# EAGLE board AD9910_Finished_3rd (EAGLE 9.6.2), part 1 of 2
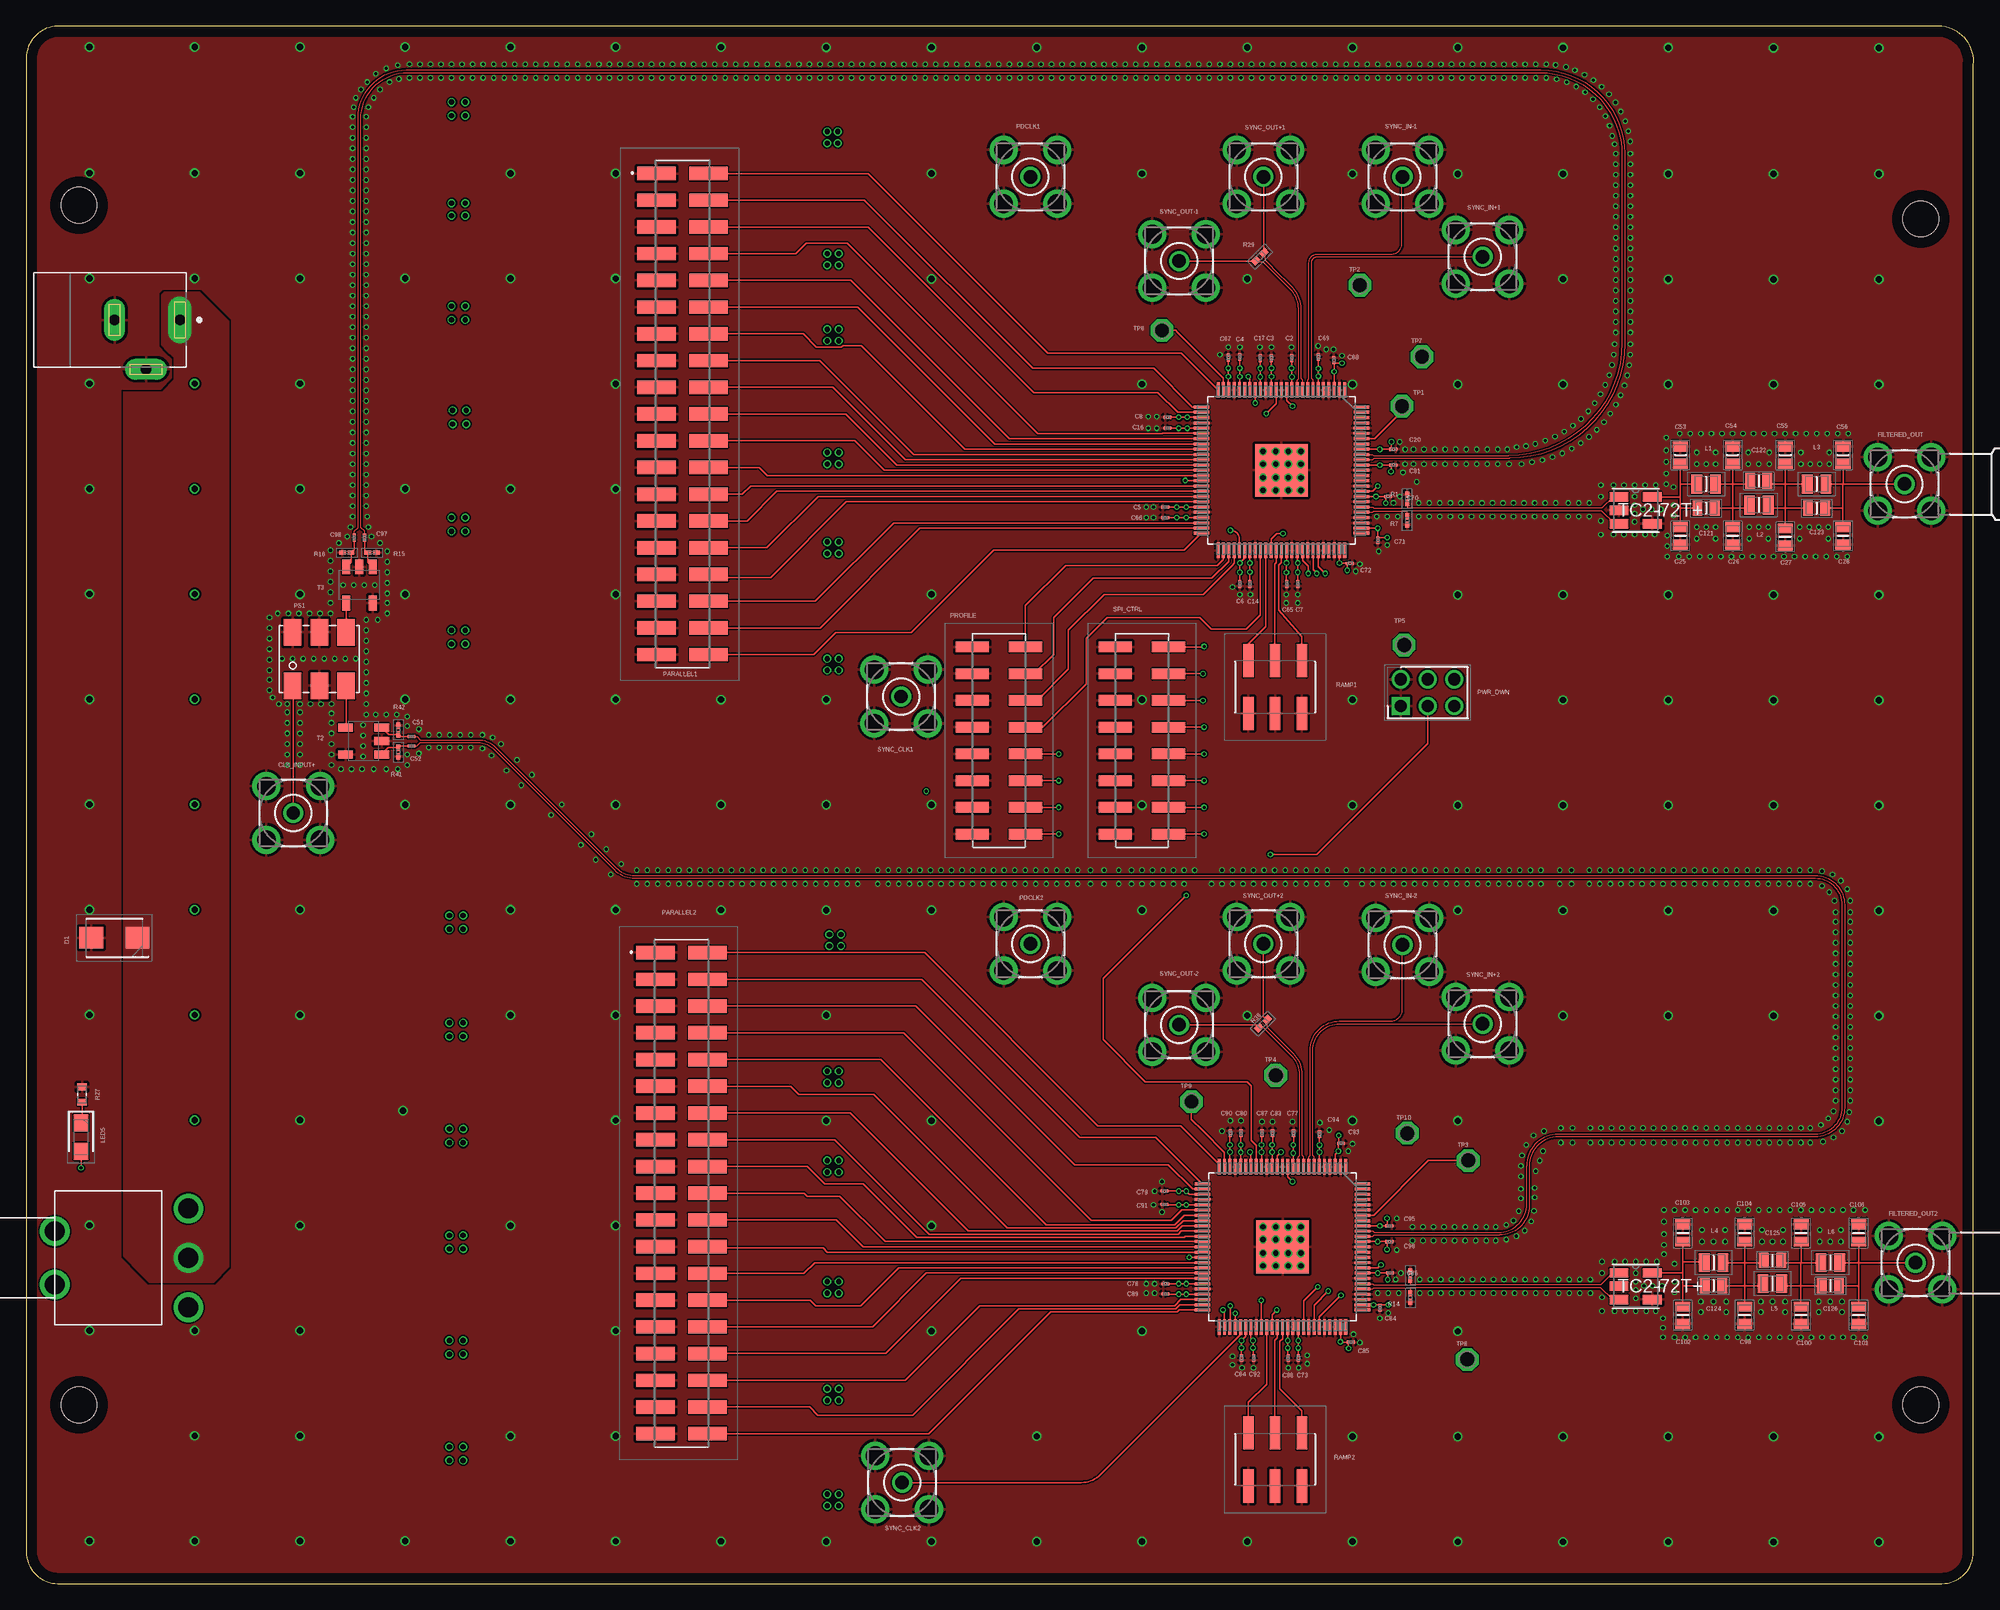
[diagram p8: board, top side]
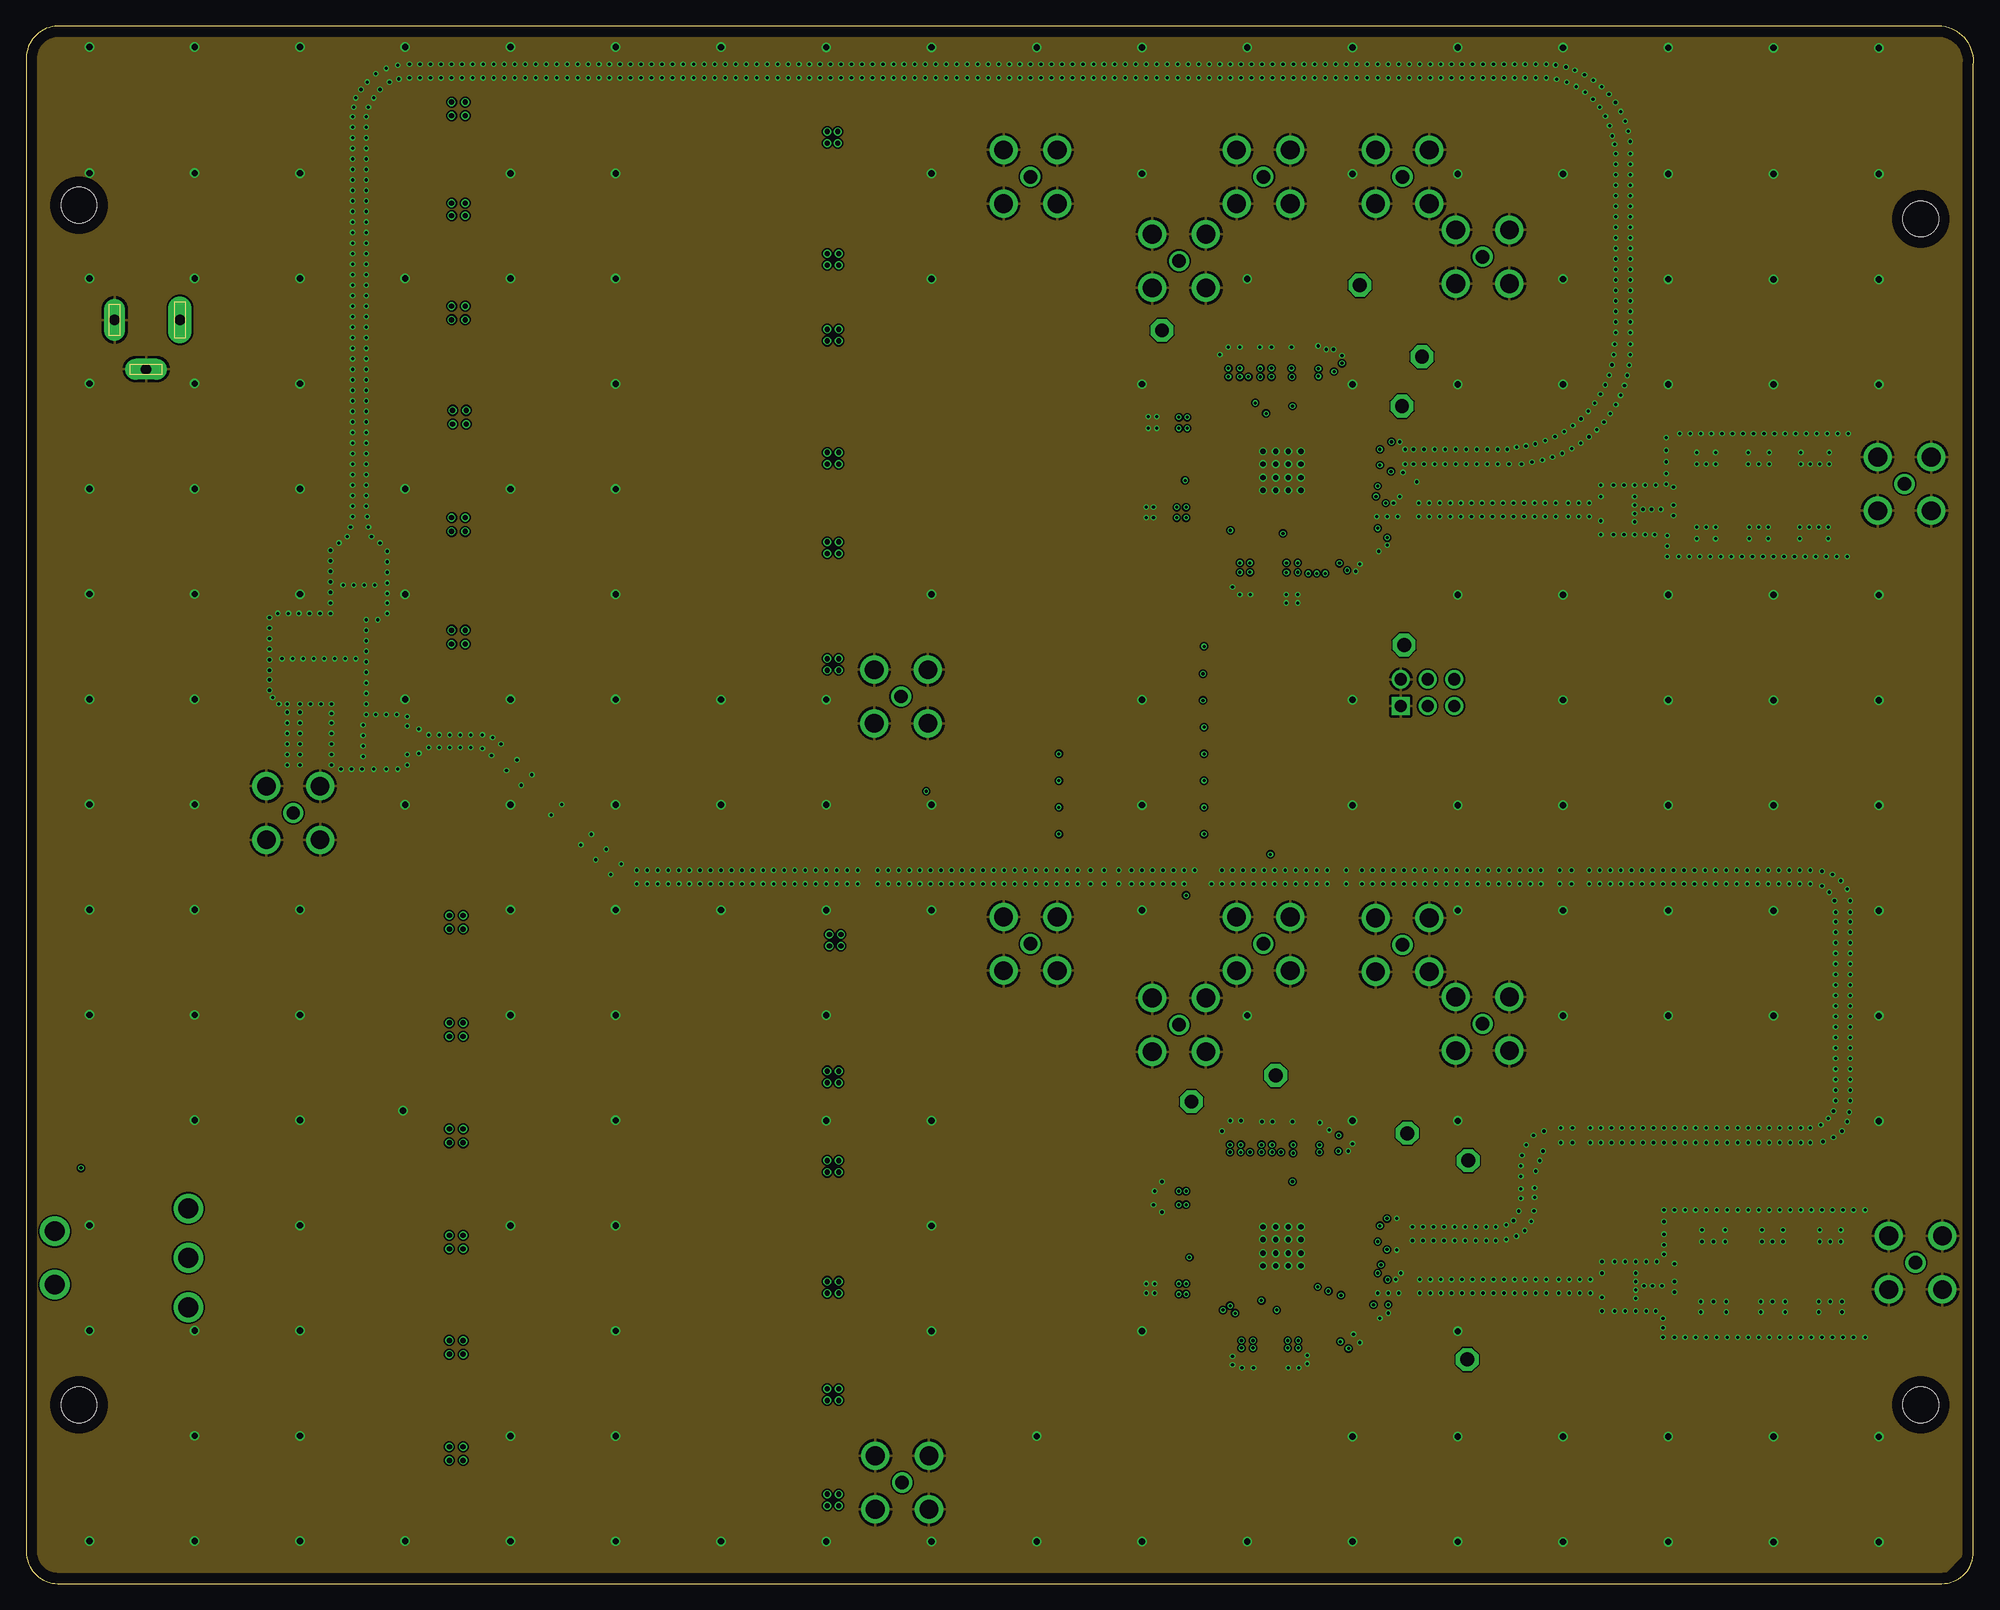
[diagram p9: board, inner layer GND]
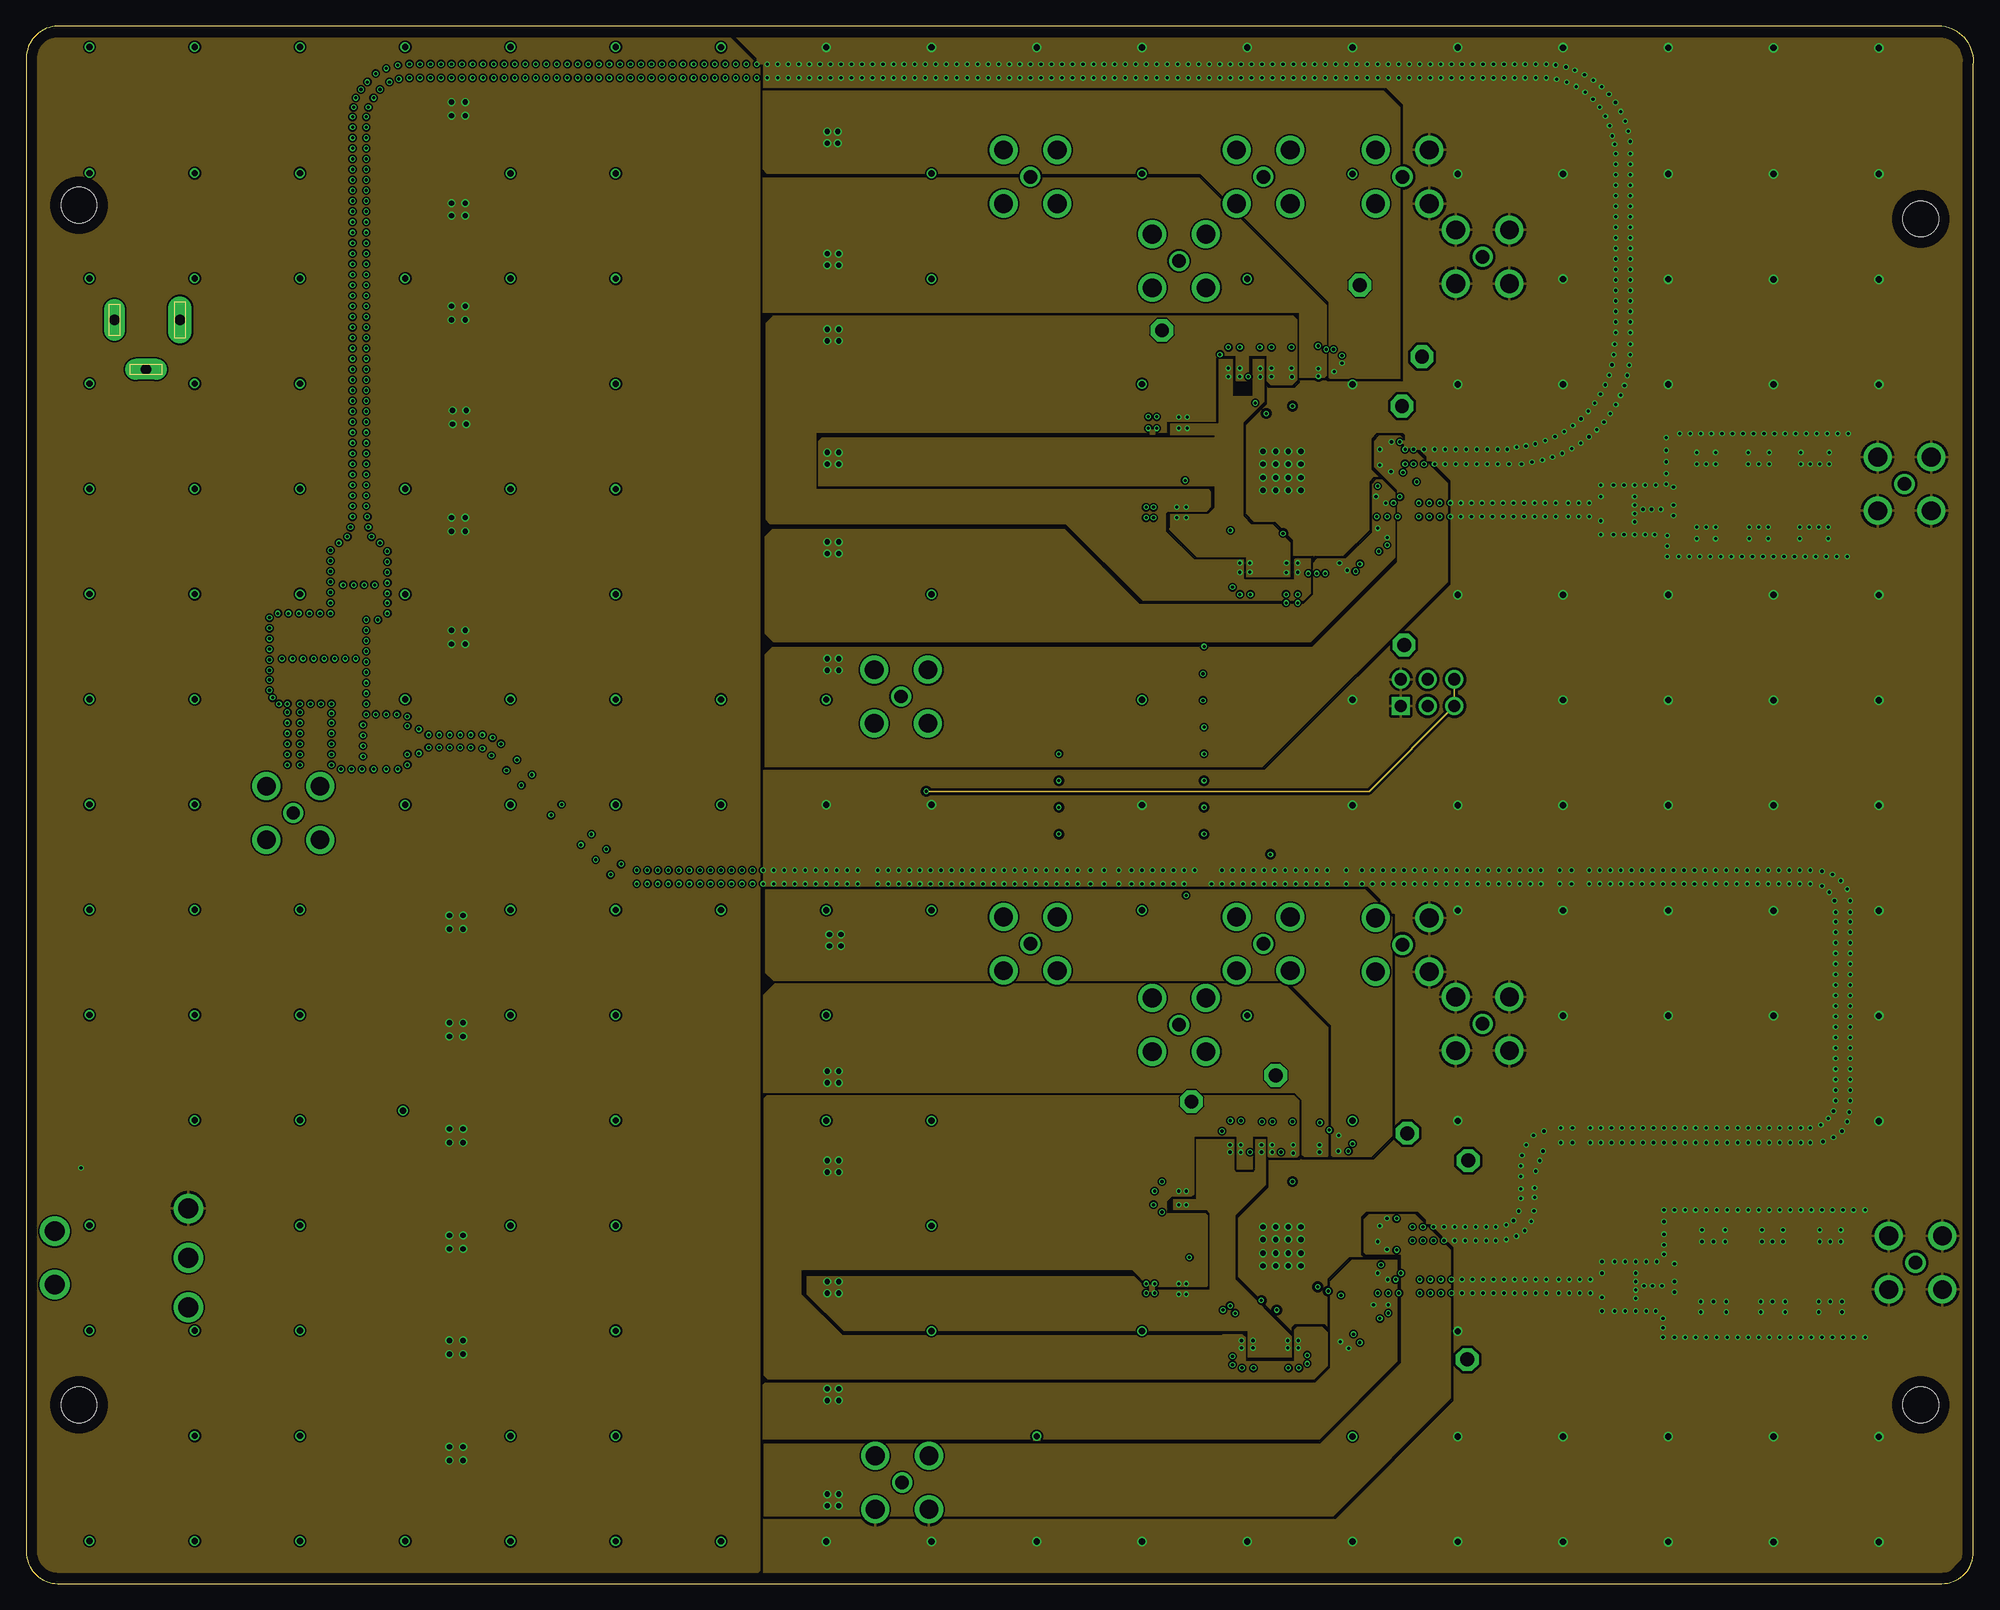
[diagram p10: board, inner layer VCC]
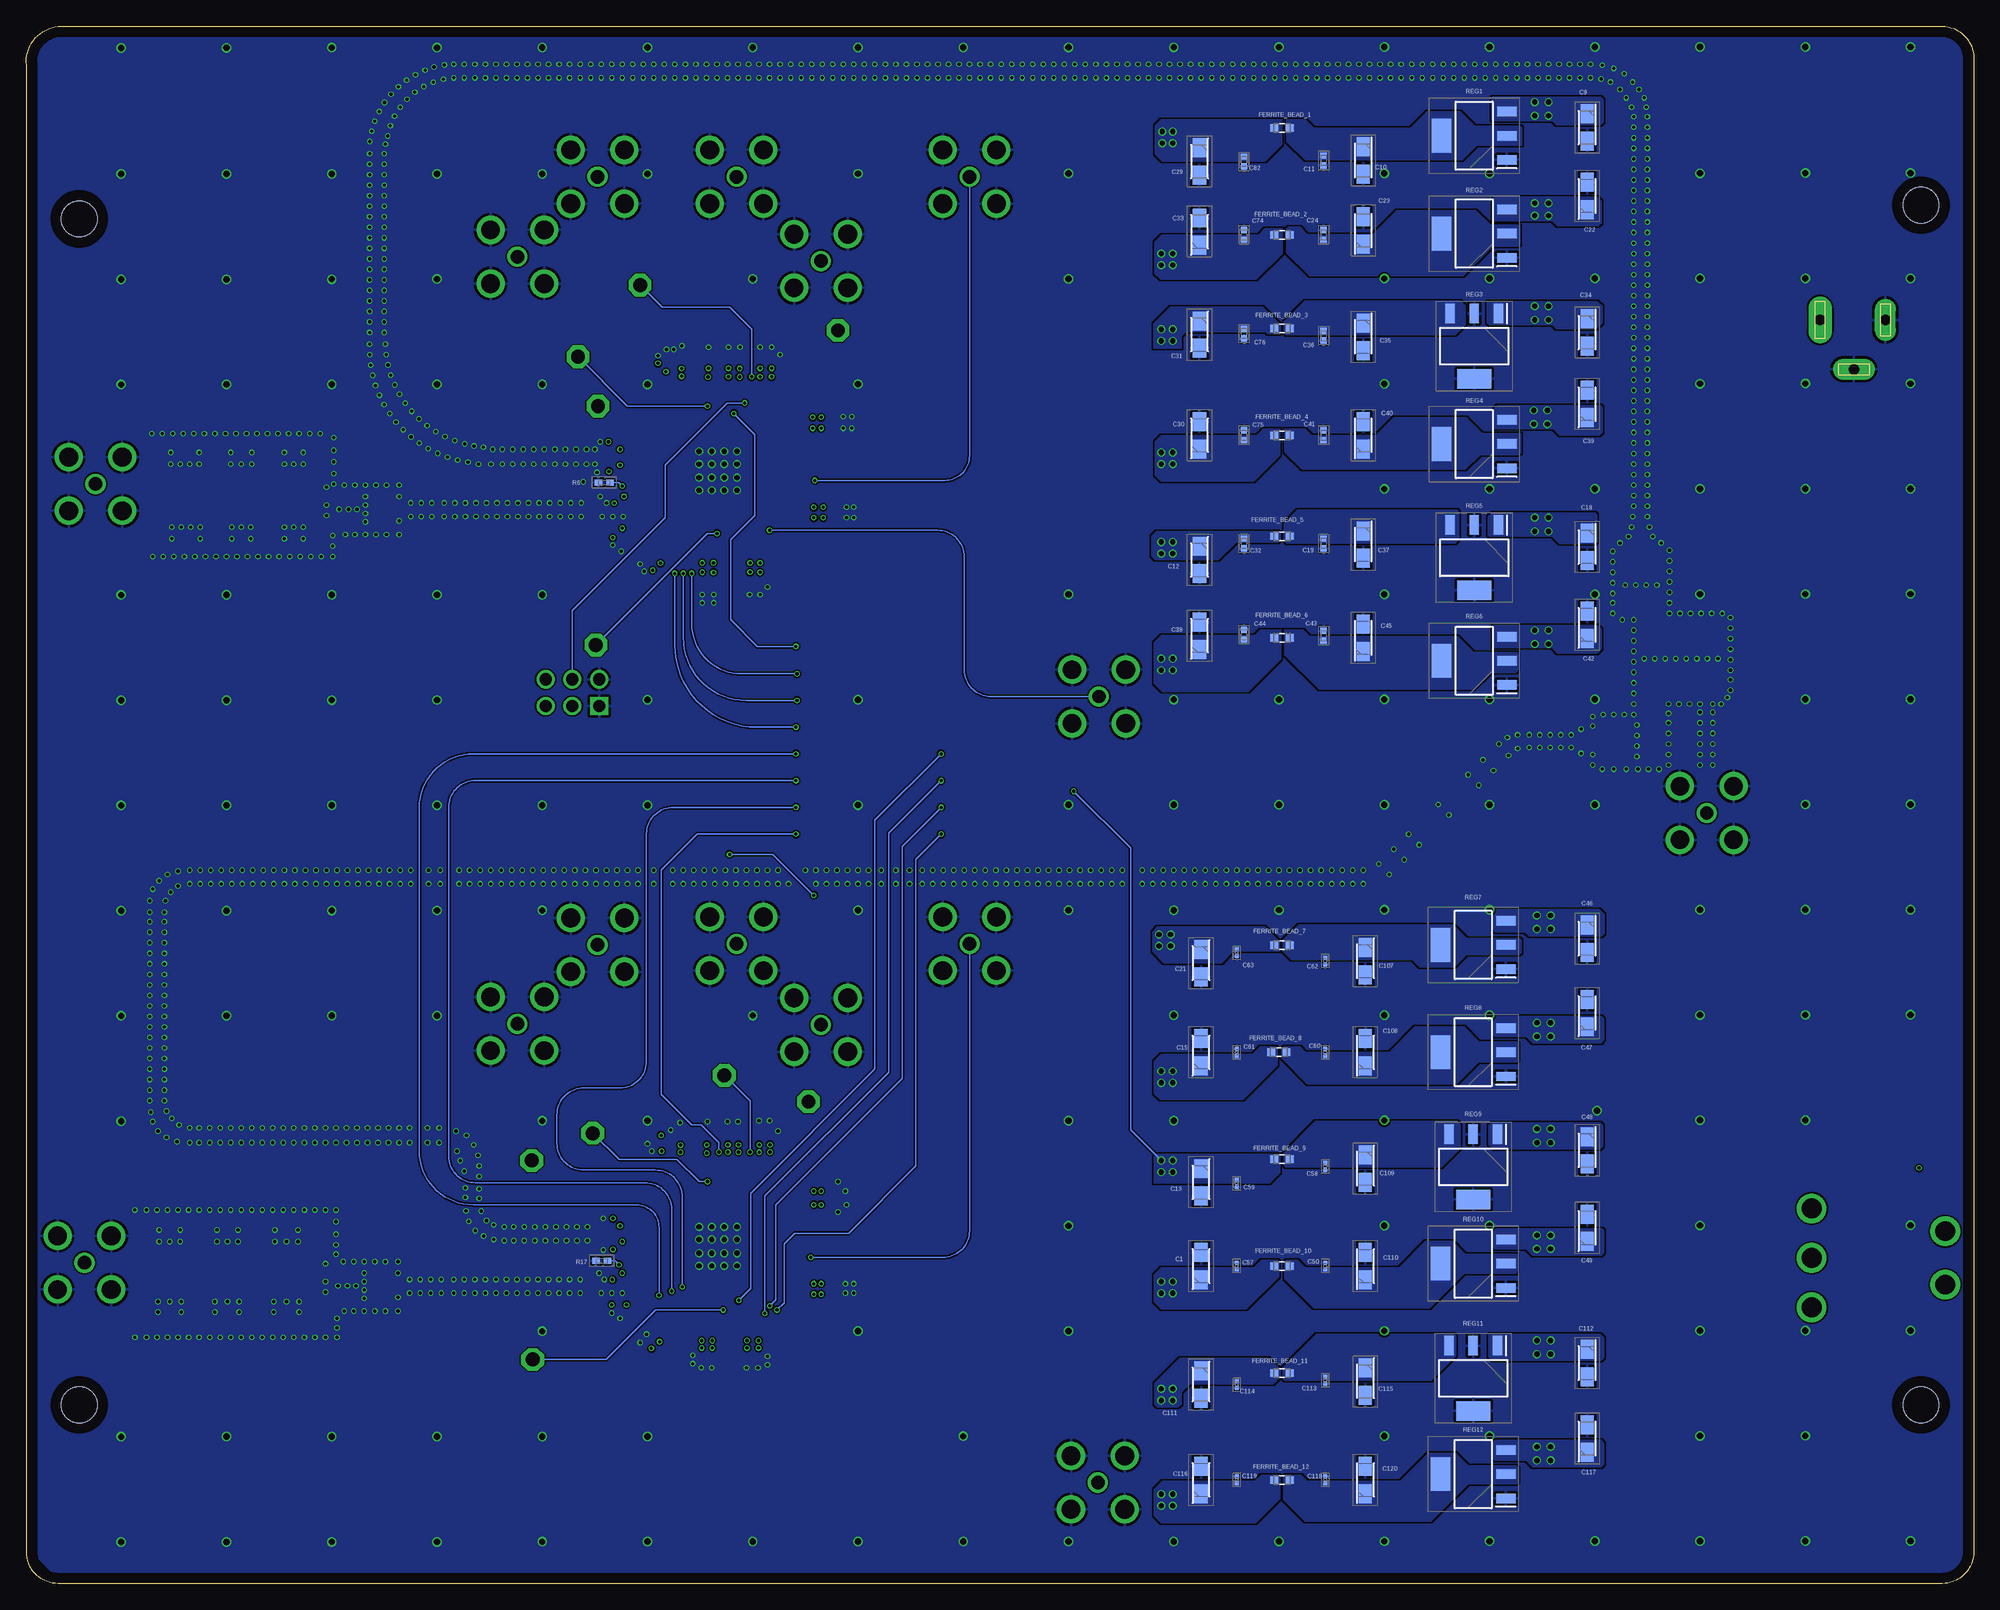
[diagram p11: board, bottom side, seen from below]

Size 185.02 x 148 mm. Coordinates in mm from the lower left corner, seen from the top.
Outline: 0,3 arc90 3,0 182,0 arc90 185,3 185,144.3 arc90 182,148 3,148 arc90 0,145 0,3
Copper layers (1+2*15+16): Top 0.035mm / dielectric 0.1008mm / GND 0.031mm / dielectric 1.238mm / VCC 0.031mm / dielectric 0.1008mm / Bottom 0.035mm
Design rules "default *": minimum track width 0.1mm, minimum drill 0.2mm, track to track 0.15mm, track to pad 0.15mm, pad to pad 0.15mm, via to via 0.15mm, smd to smd 0.15mm, copper to edge 40mil, drill to drill 6mil, minimum pad ring 10mil, minimum via ring 0.1mm, stop-mask expansion 4mil, vias tented up to drill 10mm, thermal gap 10mil
Net classes: 1 diff: width 0.105 mm, drill 0.008 mm, clearance 0.15 mm; 2 ground: drill 0.3 mm; 3 single: width 0.145 mm, drill 0.3 mm, clearance 0.15 mm
Holes 3.4 mm at 5,17 5,131 180,129.7 180,17

## Footprints (pad centres in the part's own frame; a part is rotated, then mirrored left to right if it is on the bottom)
CAPPM3216X180N = smd 1.8 x 1.25: 1 -1.3,0; 2 1.3,0
CAPC0402X22N = smd 0.29 x 0.3: 1 -0.222,0; 2 0.222,0
CAPC1005X22N = smd 0.6 x 0.62: 1 -0.46,0; 2 0.46,0
CAPC2012X100N = smd 0.94 x 1.43: 1 -0.82,0; 2 0.82,0
CAPC0502X28N = smd 0.415 x 0.38: 1 -0.308,0; 2 0.308,0
BU-SMA-V = drill 1.27: 1 0,0 | drill 1.778: 2 -2.55,2.55; 3 2.55,2.55; 4 2.55,-2.55; 5 -2.55,-2.55
DIOM5336X241N = smd 2.25 x 2.05: 1 -2.2,0; 2 2.2,0
WE-CBF_0603(W=2.2) = smd 0.75 x 0.7: 1 -0.725,0; 2 0.725,0
BU-SMA-H = drill 1.27: 1 0,0 | drill 1.778: 2 -2.55,2.55; 3 2.55,2.55; 4 2.55,-2.55; 5 -2.55,-2.55
KYCON_KLDX-0202-AC = drill 1 pad 2.25 long: 1 -6.65,0 | drill 1 pad 2 long: 2 -0.45,0; 3 -3.45,4.7
LQW2BAN11NG00L = smd 1.02 x 1.78: 1 -0.89,0; 2 0.89,0
LEDC3412X115N = smd 1.6 x 1.4: 1 -1.35,0; 2 1.35,0
TSM-119-YY-ZZZ-DV = smd 1.27 x 3.68: 1 22.86,2.475; 2 22.86,-2.475; 3 20.32,2.475; 4 20.32,-2.475; 5 17.78,2.475; 6 17.78,-2.475; 7 15.24,2.475; 8 15.24,-2.475; 9 12.7,2.475; 10 12.7,-2.475; 11 10.16,2.475; 12 10.16,-2.475; 13 7.62,2.475; 14 7.62,-2.475; 15 5.08,2.475; 16 5.08,-2.475; 17 2.54,2.475; 18 2.54,-2.475; 19 0,2.475; 20 0,-2.475; 21 -2.54,2.475; 22 -2.54,-2.475; 23 -5.08,2.475; 24 -5.08,-2.475; 25 -7.62,2.475; 26 -7.62,-2.475; 27 -10.16,2.475; 28 -10.16,-2.475; 29 -12.7,2.475; 30 -12.7,-2.475; 31 -15.24,2.475; 32 -15.24,-2.475; 33 -17.78,2.475; 34 -17.78,-2.475; 35 -20.32,2.475; 36 -20.32,-2.475; 37 -22.86,2.475; 38 -22.86,-2.475
M208760842P = smd 1 x 3.15: 1 -8.89,-2.525; 2 -8.89,2.525; 3 -6.35,-2.525; 4 -6.35,2.525; 5 -3.81,-2.525; 6 -3.81,2.525; 7 -1.27,-2.525; 8 -1.27,2.525; 9 1.27,-2.525; 10 1.27,2.525; 11 3.81,-2.525; 12 3.81,2.525; 13 6.35,-2.525; 14 6.35,2.525; 15 8.89,-2.525; 16 8.89,2.525
CD636 = smd 1.651 x 2.54: 1 0,0; 2 2.54,0; 3 5.08,0; 4 5.08,5.08; 5 2.54,5.08; 6 0,5.08
HDRV6W67P254_2X3_762X483X858P = drill 1.15 pad 1.725 square: 1 0,0 | drill 1.15 pad 1.725: 2 0,2.54; 3 2.54,0; 4 2.54,2.54; 5 5.08,0; 6 5.08,2.54
RESC0603X26N = smd 0.6 x 0.4: 1 -0.4,0; 2 0.4,0
RESC1005X40N = smd 0.7 x 0.6: 1 -0.55,0; 2 0.55,0
RESC0603X28N = smd 0.625 x 0.4: 1 -0.412,0; 2 0.412,0
RES_ERA3VEB3000V = smd 0.65 x 0.9: 1 -0.725,0; 2 0.725,0
RESC1005X35N = smd 0.75 x 0.6: 1 -0.55,0; 2 0.55,0
M208760342R = smd 1 x 3.15: 1 -2.54,-2.525; 2 -2.54,2.525; 3 0,-2.525; 4 0,2.525; 5 2.54,-2.525; 6 2.54,2.525
SOT230P700X180-4N = smd 1.85 x 0.9: 1 -3.1,2.3; 2 -3.1,0; 3 -3.1,-2.3 | smd 1.85 x 3.2: 4 3.1,0
TOGGLE_RA = drill 1.88: 1 4.699,12.7; 2 0,12.7; 3 -4.699,12.7; P$4 -2.54,0; P$5 2.54,0
AT1521_MNC = smd 1.778 x 0.889: 1 -1.587,-1.27; 2 -1.587,0; 3 -1.587,1.27; 4 1.587,1.27; 6 1.587,-1.27
SM22 = smd 0.762 x 1.397: 1 -1.27,1.714; 2 0,1.714; 3 1.27,1.714; 4 1.27,-1.714; 5 -1.27,-1.714
P1-13 = drill 1.321 pad 2.159 octagon: TP 0,0
QFP50P1600X1600X120-101N = smd 1.473 x 0.279: 1 -7.62,5.994; 2 -7.62,5.512; 3 -7.62,5.004; 4 -7.62,4.496; 5 -7.62,3.988; 6 -7.62,3.505; 7 -7.62,2.997; 8 -7.62,2.489; 9 -7.62,2.007; 10 -7.62,1.499; 11 -7.62,0.991; 12 -7.62,0.508; 13 -7.62,0; 14 -7.62,-0.508; 15 -7.62,-0.991; 16 -7.62,-1.499; 17 -7.62,-2.007; 18 -7.62,-2.489; 19 -7.62,-2.997; 20 -7.62,-3.505; 21 -7.62,-3.988; 22 -7.62,-4.496; 23 -7.62,-5.004; 24 -7.62,-5.512; 25 -7.62,-5.994; 51 7.62,-5.994; 52 7.62,-5.512; 53 7.62,-5.004; 54 7.62,-4.496; 55 7.62,-3.988; 56 7.62,-3.505; 57 7.62,-2.997; 58 7.62,-2.489; 59 7.62,-2.007; 60 7.62,-1.499; 61 7.62,-0.991; 62 7.62,-0.508; 63 7.62,0; 64 7.62,0.508; 65 7.62,0.991; 66 7.62,1.499; 67 7.62,2.007; 68 7.62,2.489; 69 7.62,2.997; 70 7.62,3.505; 71 7.62,3.988; 72 7.62,4.496; 73 7.62,5.004; 74 7.62,5.512; 75 7.62,5.994 | smd 0.279 x 1.473: 26 -5.994,-7.62; 27 -5.512,-7.62; 28 -5.004,-7.62; 29 -4.496,-7.62; 30 -3.988,-7.62; 31 -3.505,-7.62; 32 -2.997,-7.62; 33 -2.489,-7.62; 34 -2.007,-7.62; 35 -1.499,-7.62; 36 -0.991,-7.62; 37 -0.508,-7.62; 38 0,-7.62; 39 0.508,-7.62; 40 0.991,-7.62; 41 1.499,-7.62; 42 2.007,-7.62; 43 2.489,-7.62; 44 2.997,-7.62; 45 3.505,-7.62; 46 3.988,-7.62; 47 4.496,-7.62; 48 5.004,-7.62; 49 5.512,-7.62; 50 5.994,-7.62; 76 5.994,7.62; 77 5.512,7.62; 78 5.004,7.62; 79 4.496,7.62; 80 3.988,7.62; 81 3.505,7.62; 82 2.997,7.62; 83 2.489,7.62; 84 2.007,7.62; 85 1.499,7.62; 86 0.991,7.62; 87 0.508,7.62; 88 0,7.62; 89 -0.508,7.62; 90 -0.991,7.62; 91 -1.499,7.62; 92 -2.007,7.62; 93 -2.489,7.62; 94 -2.997,7.62; 95 -3.505,7.62; 96 -3.988,7.62; 97 -4.496,7.62; 98 -5.004,7.62; 99 -5.512,7.62; 100 -5.994,7.62 | smd 5.004 x 5.004: 101 0,0

## Placement (x,y rotation side)
C1  [CAPPM3216X180N]  73.41,30.17 90 bottom
C2  [CAPC0402X22N]  120.22,116.47 90 top
C3  [CAPC0402X22N]  118.3,116.47 90 top
C4  [CAPC0402X22N]  115.29,116.57 90 top
C5  [CAPC0402X22N]  108.2,102.3 180 top
C6  [CAPC0402X22N]  115.3,95 270 top
C7  [CAPC0402X22N]  120.8,95 270 top
C8  [CAPC0402X22N]  108.44,110.84 180 top
C9  [CAPPM3216X180N]  36.73,138.38 270 bottom
C10  [CAPPM3216X180N]  58,135.25 270 bottom
C11  [CAPC1005X22N]  61.76,135.25 270 bottom
C12  [CAPPM3216X180N]  73.56,97.28 270 bottom
C13  [CAPPM3216X180N]  73.41,38.13 270 bottom
C14  [CAPC0402X22N]  116.25,94.99 270 top
C15  [CAPPM3216X180N]  73.41,50.49 90 bottom
C16  [CAPC0402X22N]  108.44,109.81 180 top
C17  [CAPC0402X22N]  117.24,116.47 90 top
C18  [CAPPM3216X180N]  36.73,98.52 270 bottom
C19  [CAPC1005X22N]  61.76,98.85 270 bottom
C20  [CAPC0402X22N]  129.88,107.8 0 top
C21  [CAPPM3216X180N]  73.41,58.95 270 bottom
C22  [CAPPM3216X180N]  36.73,131.89 90 bottom
C23  [CAPPM3216X180N]  58,128.59 90 bottom
C24  [CAPC1005X22N]  61.76,128.19 90 bottom
C25  [CAPC2012X100N]  157.14,99.57 270 top
C26  [CAPC2012X100N]  162.12,99.57 270 top
C27  [CAPC2012X100N]  167.11,99.47 270 top
C28  [CAPC2012X100N]  172.6,99.57 270 top
C29  [CAPPM3216X180N]  73.56,135.15 270 bottom
C30  [CAPPM3216X180N]  73.56,109.14 90 bottom
C31  [CAPPM3216X180N]  73.56,118.7 270 bottom
C32  [CAPC1005X22N]  69.33,98.85 270 bottom
C33  [CAPPM3216X180N]  73.56,128.49 90 bottom
C34  [CAPPM3216X180N]  36.73,118.9 270 bottom
C35  [CAPPM3216X180N]  58,118.5 270 bottom
C36  [CAPC1005X22N]  61.76,118.6 270 bottom
C37  [CAPPM3216X180N]  58,98.75 270 bottom
C38  [CAPPM3216X180N]  73.56,90.09 90 bottom
C39  [CAPPM3216X180N]  36.73,112.11 90 bottom
C40  [CAPPM3216X180N]  58,109.14 90 bottom
C41  [CAPC1005X22N]  61.76,109.14 90 bottom
C42  [CAPPM3216X180N]  36.73,91.13 90 bottom
C43  [CAPC1005X22N]  61.76,90.09 90 bottom
C44  [CAPC1005X22N]  69.33,90.19 90 bottom
C45  [CAPPM3216X180N]  58,89.89 90 bottom
C46  [CAPPM3216X180N]  36.73,61.28 270 bottom
C47  [CAPPM3216X180N]  36.73,54.22 90 bottom
C48  [CAPPM3216X180N]  36.73,41.16 270 bottom
C49  [CAPPM3216X180N]  36.73,33.81 90 bottom
C50  [CAPC0502X28N]  61.61,30.17 90 bottom
C51  [CAPC0402X22N]  36.6,79.6 0 top
C52  [CAPC0402X22N]  36.6,80.5 180 top
C53  [CAPC2012X100N]  157.14,107.25 90 top
C54  [CAPC2012X100N]  162.12,107.25 90 top
C55  [CAPC2012X100N]  167.11,107.25 90 top
C56  [CAPC2012X100N]  172.6,107.25 90 top
C57  [CAPC0502X28N]  70.03,30.17 90 bottom
C58  [CAPC0502X28N]  61.61,39.63 270 bottom
C59  [CAPC0502X28N]  70.03,38.03 270 bottom
C60  [CAPC0502X28N]  61.61,50.49 90 bottom
C61  [CAPC0502X28N]  70.03,50.49 90 bottom
C62  [CAPC0502X28N]  61.61,59.15 270 bottom
C63  [CAPC0502X28N]  70.03,59.95 270 bottom
C64  [CAPC0402X22N]  115.45,21.44 270 top
C65  [CAPC0402X22N]  119.76,95 270 top
C66  [CAPC0402X22N]  108.2,101.3 180 top
C67  [CAPC0402X22N]  114.2,116.52 90 top
C68  [CAPC0402X22N]  124.23,116.27 90 top
C69  [CAPC0402X22N]  122.76,116.57 90 top
C70  [CAPC0402X22N]  129.38,103.32 0 top
C71  [CAPC0402X22N]  128.41,99.16 270 top
C72  [CAPC0402X22N]  125.75,96.95 0 top
C73  [CAPC0402X22N]  120.86,21.44 270 top
C74  [CAPC1005X22N]  69.33,128.19 90 bottom
C75  [CAPC1005X22N]  69.33,109.14 90 bottom
C76  [CAPC1005X22N]  69.33,118.8 270 bottom
C77  [CAPC0402X22N]  120.4,42.8 90 top
C78  [CAPC0402X22N]  108.23,28.5 180 top
C79  [CAPC0402X22N]  108.13,37.31 180 top
C80  [CAPC0402X22N]  115.4,42.8 90 top
C81  [CAPC0402X22N]  129.88,106.31 0 top
C82  [CAPC1005X22N]  69.33,135.15 270 bottom
C83  [CAPC0402X22N]  118.4,42.8 90 top
C84  [CAPC0402X22N]  128.61,26.24 270 top
C85  [CAPC0402X22N]  125.84,22.95 0 top
C86  [CAPC0402X22N]  129.57,29.54 0 top
C87  [CAPC0402X22N]  117.4,42.8 90 top
C88  [CAPC0402X22N]  119.88,21.44 270 top
C89  [CAPC0402X22N]  108.23,27.54 180 top
C90  [CAPC0402X22N]  114.4,42.8 90 top
C91  [CAPC0402X22N]  108.13,36.04 180 top
C92  [CAPC0402X22N]  116.62,21.44 270 top
C93  [CAPC0402X22N]  124.92,41.85 0 top
C94  [CAPC0402X22N]  122.86,42.7 90 top
C95  [CAPC0402X22N]  129.5,34 0 top
C96  [CAPC0402X22N]  129.5,32.5 0 top
C97  [CAPC0402X22N]  32.13,99.4 90 top
C98  [CAPC0402X22N]  31.16,99.4 90 top
C99  [CAPC2012X100N]  163.25,25.5 270 top
C100  [CAPC2012X100N]  168.62,25.5 270 top
C101  [CAPC2012X100N]  174.08,25.5 270 top
C102  [CAPC2012X100N]  157.38,25.5 270 top
C103  [CAPC2012X100N]  157.38,33.32 90 top
C104  [CAPC2012X100N]  163.25,33.32 90 top
C105  [CAPC2012X100N]  168.62,33.32 90 top
C106  [CAPC2012X100N]  174.08,33.32 90 top
C107  [CAPPM3216X180N]  57.8,59.15 270 bottom
C108  [CAPPM3216X180N]  57.8,50.49 90 bottom
C109  [CAPPM3216X180N]  57.8,39.43 270 bottom
C110  [CAPPM3216X180N]  57.8,30.17 90 bottom
C111  [CAPPM3216X180N]  73.41,18.91 270 bottom
C112  [CAPPM3216X180N]  36.73,20.95 270 bottom
C113  [CAPC0502X28N]  61.61,19.31 270 bottom
C114  [CAPC0502X28N]  70.03,18.91 270 bottom
C115  [CAPPM3216X180N]  57.8,19.21 270 bottom
C116  [CAPPM3216X180N]  73.41,9.85 90 bottom
C117  [CAPPM3216X180N]  36.73,13.79 90 bottom
C118  [CAPC0502X28N]  61.61,9.85 90 bottom
C119  [CAPC0502X28N]  70.03,9.85 90 bottom
C120  [CAPPM3216X180N]  57.8,9.85 90 bottom
C121  [CAPC2012X100N]  159.6,102.2 0 top
C122  [CAPC2012X100N]  164.6,104.8 0 top
C123  [CAPC2012X100N]  170.1,102.2 0 top
C124  [CAPC2012X100N]  160.3,28.3 0 top
C125  [CAPC2012X100N]  165.9,30.7 0 top
C126  [CAPC2012X100N]  171.4,28.3 0 top
CLK_INPUT+  BU-SMA-V  [BU-SMA-V]  25.36,73.23 0 top
D1  SMBJ5340B-TP  [DIOM5336X241N]  8.37,61.37 180 top
FERRITE_BEAD_1  [WE-CBF_0603(W=2.2)]  65.72,138.35 180 bottom
FERRITE_BEAD_2  [WE-CBF_0603(W=2.2)]  65.72,128.19 180 bottom
FERRITE_BEAD_3  [WE-CBF_0603(W=2.2)]  65.72,119.3 180 bottom
FERRITE_BEAD_4  [WE-CBF_0603(W=2.2)]  65.72,109.14 180 bottom
FERRITE_BEAD_5  [WE-CBF_0603(W=2.2)]  65.72,99.55 180 bottom
FERRITE_BEAD_6  [WE-CBF_0603(W=2.2)]  65.72,89.89 180 bottom
FERRITE_BEAD_7  [WE-CBF_0603(W=2.2)]  65.72,60.65 180 bottom
FERRITE_BEAD_8  [WE-CBF_0603(W=2.2)]  66.02,50.49 180 bottom
FERRITE_BEAD_9  [WE-CBF_0603(W=2.2)]  65.72,40.33 180 bottom
FERRITE_BEAD_10  [WE-CBF_0603(W=2.2)]  65.72,30.17 180 bottom
FERRITE_BEAD_11  [WE-CBF_0603(W=2.2)]  65.72,20.01 180 bottom
FERRITE_BEAD_12  [WE-CBF_0603(W=2.2)]  65.72,9.85 180 bottom
FILTERED_OUT  BU-SMA-H  [BU-SMA-H]  178.45,104.51 0 top
FILTERED_OUT2  BU-SMA-H  [BU-SMA-H]  179.49,30.5 0 top
J1  KLDX-0202-AC  [KYCON_KLDX-0202-AC]  7.94,120.1 180 top
L1  [LQW2BAN11NG00L]  159.6,104.5 0 top
L2  [LQW2BAN11NG00L]  164.6,102.5 0 top
L3  [LQW2BAN11NG00L]  170.1,104.5 0 top
L4  [LQW2BAN11NG00L]  160.3,30.5 0 top
L5  [LQW2BAN11NG00L]  165.9,28.5 0 top
L6  [LQW2BAN11NG00L]  171.4,30.5 0 top
LED5  SML-811UTT86C  [LEDC3412X115N]  5.2,42.43 270 top
PARALLEL1  TSM-119-04-L-DV  [TSM-119-YY-ZZZ-DV]  62.35,111.15 90 top
PARALLEL2  TSM-119-04-L-DV  [TSM-119-YY-ZZZ-DV]  62.25,37.1 90 top
PDCLK1  BU-SMA-V  [BU-SMA-V]  95.4,133.7 90 top
PDCLK2  BU-SMA-V  [BU-SMA-V]  95.4,60.8 0 top
PROFILE  M20-8760842P  [M208760842P]  92.4,80.12 270 top
PS1  ADP-2-10  [CD636]  25.3,85.33 0 top
PWR_DWN  67996-106HLF  [HDRV6W67P254_2X3_762X483X858P]  130.6,83.4 0 top
R1  [RESC0603X26N]  131.2,103.1 90 top
R6  [RESC1005X40N]  130.11,104.64 180 bottom
R7  [RESC0603X26N]  131.2,101.04 90 top
R13  [RESC0603X26N]  131.5,29.27 90 top
R14  [RESC0603X26N]  131.5,27.18 90 top
R15  [RESC0603X28N]  32.85,97.98 180 top
R16  [RESC0603X28N]  30.45,97.98 0 top
R17  [RESC1005X40N]  130.35,30.68 180 bottom
R27  300  [RES_ERA3VEB3000V]  5.3,46.48 270 top
R29  [RESC1005X35N]  117.2,126.1 45 top
R36  [RESC1005X35N]  117.5,53.2 45 top
R41  [RESC0603X28N]  35.35,79.03 90 top
R42  [RESC0603X28N]  35.35,81.13 270 top
RAMP1  M20-8760342R  [M208760342R]  118.65,85.2 0 top
RAMP2  M20-8760342R  [M208760342R]  118.65,11.8 0 top
REG1  [SOT230P700X180-4N]  47.45,137.6 180 bottom
REG2  [SOT230P700X180-4N]  47.45,128.3 180 bottom
REG3  [SOT230P700X180-4N]  47.45,117.6 270 bottom
REG4  [SOT230P700X180-4N]  47.45,108.3 180 bottom
REG5  [SOT230P700X180-4N]  47.45,97.5 270 bottom
REG6  [SOT230P700X180-4N]  47.45,87.7 180 bottom
REG7  AZ1117CH-1.8TRG1  [SOT230P700X180-4N]  47.55,60.7 180 bottom
REG8  AZ1117CH-1.8TRG1  [SOT230P700X180-4N]  47.55,50.5 180 bottom
REG9  TPS7B8333QDCYRQ1  [SOT230P700X180-4N]  47.55,39.6 270 bottom
REG10  AZ1117CH-1.8TRG1  [SOT230P700X180-4N]  47.55,30.4 180 bottom
REG11  TPS7B8333QDCYRQ1  [SOT230P700X180-4N]  47.55,19.5 270 bottom
REG12  AZ1117CH-1.8TRG1  [SOT230P700X180-4N]  47.55,10.4 180 bottom
SPI_CTRL  M20-8760842P  [M208760842P]  106,80.12 270 top
SW1  100SP1T2B4M6QE  [TOGGLE_RA]  2.69,30.95 270 top
SYNC_CLK1  BU-SMA-V  [BU-SMA-V]  83.11,84.3 90 top
SYNC_CLK2  BU-SMA-V  [BU-SMA-V]  83.21,9.6 270 top
SYNC_IN+1  BU-SMA-V  [BU-SMA-V]  138.36,126.1 90 top
SYNC_IN+2  BU-SMA-V  [BU-SMA-V]  138.36,53.2 0 top
SYNC_IN-1  BU-SMA-V  [BU-SMA-V]  130.75,133.7 90 top
SYNC_IN-2  BU-SMA-V  [BU-SMA-V]  130.75,60.7 0 top
SYNC_OUT+1  BU-SMA-V  [BU-SMA-V]  117.54,133.7 90 top
SYNC_OUT+2  BU-SMA-V  [BU-SMA-V]  117.54,60.8 0 top
SYNC_OUT-1  BU-SMA-V  [BU-SMA-V]  109.52,125.7 90 top
SYNC_OUT-2  BU-SMA-V  [BU-SMA-V]  109.52,53.1 0 top
T1  TC2-72T+  [AT1521_MNC]  152.9,102 0 top
T2  ETC1-1-13TR  [SM22]  32.05,80.08 270 top
T3  ETC1-1-13TR  [SM22]  31.65,94.9 0 top
T4  TC2-72T+  [AT1521_MNC]  152.9,28.26 0 top
TP1  TPPAD1-13  [P1-13]  130.7,111.9 0 top
TP2  TPPAD1-13  [P1-13]  126.7,123.4 0 top
TP3  TPPAD1-13  [P1-13]  137,40.2 0 top
TP4  TPPAD1-13  [P1-13]  118.7,48.3 0 top
TP5  TPPAD1-13  [P1-13]  130.9,89.2 0 top
TP6  TPPAD1-13  [P1-13]  107.9,119.1 0 top
TP7  TPPAD1-13  [P1-13]  132.6,116.6 0 top
TP8  TPPAD1-13  [P1-13]  136.9,21.3 0 top
TP9  TPPAD1-13  [P1-13]  110.7,45.8 0 top
TP10  TPPAD1-13  [P1-13]  131.2,42.8 0 top
U1  AD9910BSVZ  [QFP50P1600X1600X120-101N]  119.25,105.81 270 top
U2  AD9910BSVZ  [QFP50P1600X1600X120-101N]  119.35,32 270 top